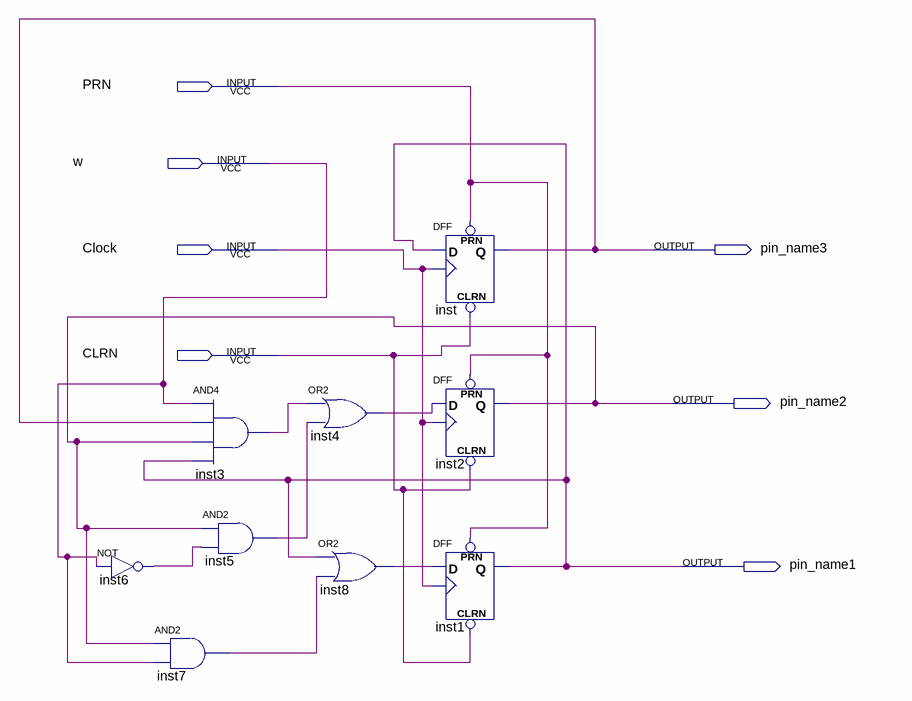
[diagram p0: schematic sheet]
// Quartus schematic lab11step2.bdf as structural Verilog: 9 symbols, 7 pins
module lab11step2 (
  input  PRN,
  input  w,
  input  Clock,
  input  CLRN,
  output pin_name3,
  output pin_name2,
  output pin_name1
);

  wire inst3_out, inst4_out, inst5_out, inst6_out, inst7_out, inst8_out;

  not inst6 (inst6_out, w);
  and inst7 (inst7_out, pin_name2, w);
  and inst3 (inst3_out, w, pin_name3, pin_name2, pin_name1);
  and inst5 (inst5_out, pin_name2, inst6_out);
  or inst4 (inst4_out, inst3_out, inst5_out);
  or inst8 (inst8_out, pin_name1, inst7_out);
  DFF inst (.CLRN(CLRN), .CLK(Clock), .D(pin_name1), .PRN(PRN), .Q(pin_name3));
  DFF inst2 (.CLRN(CLRN), .CLK(Clock), .D(inst4_out), .PRN(PRN), .Q(pin_name2));
  DFF inst1 (.CLRN(CLRN), .CLK(Clock), .D(inst8_out), .PRN(PRN), .Q(pin_name1));
endmodule
